# Altium schematic sheet Connections.SchDoc
size A4; SheetNumber: 1; SheetTotal: 2
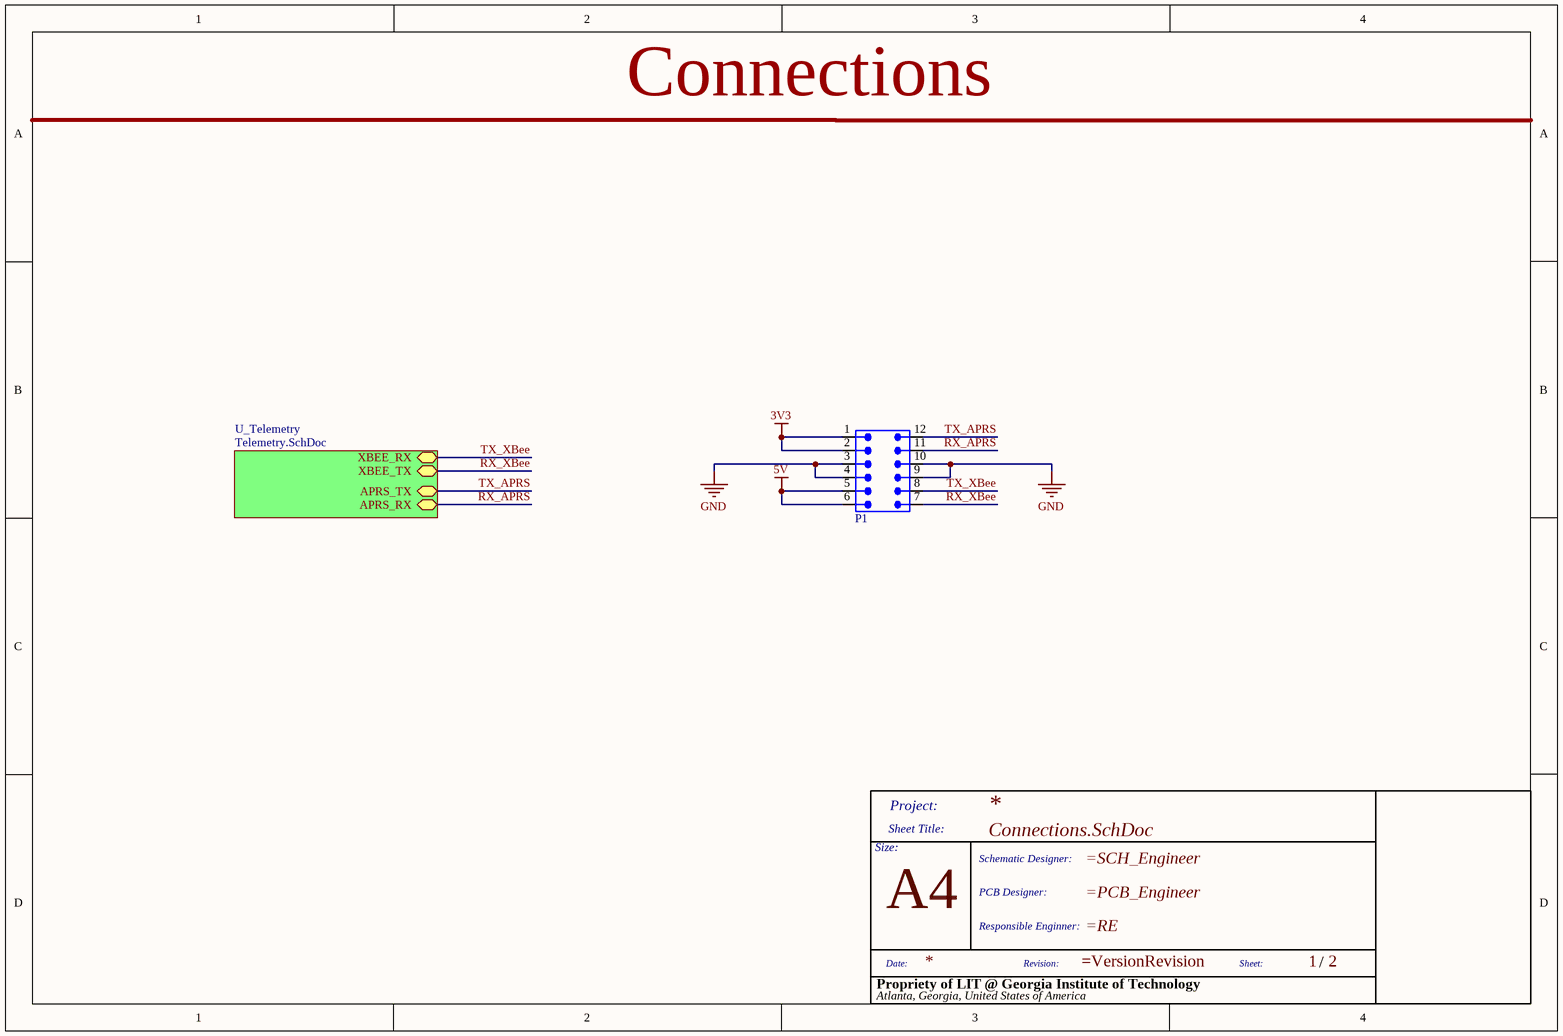
[diagram p0: Connections.SchDoc]

## Parts
*  Size: A4  (hidden comment: TitleBlock)  (graphical)
P1  HTST-106-01-L-DV-P-TR  [HTST-106-01-L-DV-P-TR]  (value not drawn)

## Sub-sheets
U_Telemetry = Telemetry.SchDoc: XBEE_RX (bidir), XBEE_TX (bidir), APRS_TX (bidir), APRS_RX (bidir)

## Nets
3V3: P1.1 P1.2
5V: P1.5 P1.6
GND: P1.3 P1.4 P1.9 P1.10
RX_APRS: P1.11 ; sheet U_Telemetry/APRS_RX
RX_XBee: P1.7 ; sheet U_Telemetry/XBEE_TX
TX_APRS: P1.12 ; sheet U_Telemetry/APRS_TX
TX_XBee: P1.8 ; sheet U_Telemetry/XBEE_RX

## Notes on the sheet
- Connections
- (in symbol TitleBlock) Project:; Sheet Title:; Size:; Schematic Designer:; PCB Designer:; Responsible Enginner:; Date:; Revision:; Sheet:; /; Propriety of LIT @ Georgia Institute of Technology; Atlanta, Georgia, United States of America

## Library data of the parts
* = TitleBlock: Standard Title Block
P1 = BoardToBoard_Bottom: Connector Header Through Hole 12 position 0.100" (2.54mm)